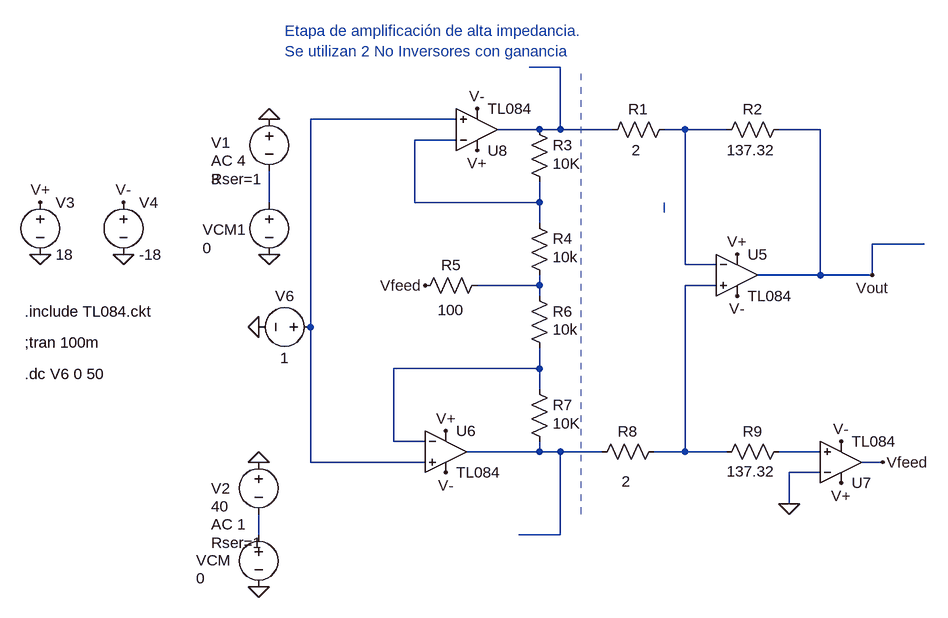
[diagram p0: schematic Draft1.asc]
Draft1.asc, the LTspice schematic file:
Version 4
SHEET 1 1008 680
WIRE 208 -240 160 -240
WIRE 48 -160 -176 -160
WIRE 176 -144 112 -144
WIRE 208 -144 208 -240
WIRE 208 -144 176 -144
WIRE 288 -144 208 -144
WIRE 400 -144 368 -144
WIRE 464 -144 400 -144
WIRE 608 -144 544 -144
WIRE 48 -128 -16 -128
WIRE -240 -32 -240 -80
WIRE -16 -32 -16 -128
WIRE 176 -32 176 -64
WIRE 176 -32 -16 -32
WIRE 176 0 176 -32
WIRE 768 32 688 32
WIRE 400 64 400 -144
WIRE 448 64 400 64
WIRE 608 80 608 -144
WIRE 608 80 512 80
WIRE 688 80 688 32
WIRE 688 80 608 80
WIRE 176 96 176 80
WIRE 176 96 80 96
WIRE 448 96 400 96
WIRE 176 112 176 96
WIRE -176 160 -176 -160
WIRE 176 224 176 192
WIRE 176 224 -48 224
WIRE 176 256 176 224
WIRE -48 336 -48 224
WIRE 0 336 -48 336
WIRE 176 352 176 336
WIRE 176 352 64 352
WIRE 208 352 176 352
WIRE 272 352 208 352
WIRE 400 352 400 96
WIRE 400 352 352 352
WIRE 464 352 400 352
WIRE 608 352 544 352
WIRE -176 368 -176 160
WIRE 0 368 -176 368
WIRE 704 368 672 368
WIRE 608 384 560 384
WIRE 560 432 560 384
WIRE -256 480 -256 448
WIRE 208 480 208 352
WIRE 208 480 144 480
FLAG 560 432 0
FLAG 704 368 Vfeed
FLAG 0 96 Vfeed
FLAG -256 560 0
FLAG -240 48 0
FLAG 688 80 Vout
FLAG -464 48 0
FLAG -592 48 0
FLAG -592 -32 V+
FLAG 80 -112 V+
FLAG 480 48 V+
FLAG 640 400 V+
FLAG 32 320 V+
FLAG -464 -32 V-
FLAG 80 -176 V-
FLAG 480 112 V-
FLAG 640 336 V-
FLAG 32 384 V-
FLAG -256 160 0
FLAG -256 368 0
FLAG -240 -160 0
DATAFLAG 768 32 ""
DATAFLAG 160 -240 ""
DATAFLAG 144 480 ""
SYMBOL res 160 -16 R0
WINDOW 3 36 68 Left 2
SYMATTR Value 10k
SYMATTR InstName R4
SYMBOL res 160 96 R0
WINDOW 3 36 68 Left 2
SYMATTR Value 10k
SYMATTR InstName R6
SYMBOL res 160 240 R0
WINDOW 3 36 68 Left 2
SYMATTR Value 10K
SYMATTR InstName R7
SYMBOL res 160 -160 R0
WINDOW 3 36 68 Left 2
SYMATTR Value 10K
SYMATTR InstName R3
SYMBOL res 384 -160 R90
WINDOW 0 0 56 VBottom 2
WINDOW 3 63 59 VBottom 2
SYMATTR InstName R1
SYMATTR Value 2
SYMBOL res 560 -160 R90
WINDOW 0 0 56 VBottom 2
WINDOW 3 63 59 VBottom 2
SYMATTR InstName R2
SYMATTR Value 137.32
SYMBOL res 368 336 R90
WINDOW 0 0 56 VBottom 2
WINDOW 3 77 59 VBottom 2
SYMATTR InstName R8
SYMATTR Value 2
SYMBOL res 96 80 R90
WINDOW 0 0 56 VBottom 2
WINDOW 3 69 56 VBottom 2
SYMATTR InstName R5
SYMATTR Value 100
SYMBOL res 560 336 R90
WINDOW 0 0 56 VBottom 2
WINDOW 3 62 59 VBottom 2
SYMATTR InstName R9
SYMATTR Value 137.32
SYMBOL voltage -240 -176 R0
WINDOW 0 -89 52 Left 2
WINDOW 123 -89 80 Left 2
WINDOW 39 -89 108 Left 2
WINDOW 3 -89 108 Left 2
SYMATTR InstName V1
SYMATTR Value2 AC 4
SYMATTR SpiceLine Rser=1
SYMATTR Value 3
SYMBOL voltage -256 352 R0
WINDOW 0 -73 56 Left 2
WINDOW 3 -73 84 Left 2
WINDOW 123 -73 112 Left 2
WINDOW 39 -73 140 Left 2
SYMATTR InstName V2
SYMATTR Value 40
SYMATTR Value2 AC 1
SYMATTR SpiceLine Rser=1
SYMBOL voltage -240 -48 R0
WINDOW 0 -102 58 Left 2
WINDOW 123 0 0 Left 0
WINDOW 39 0 0 Left 0
WINDOW 3 -102 86 Left 2
SYMATTR InstName VCM1
SYMATTR Value 0
SYMBOL voltage -256 464 R0
WINDOW 0 -96 55 Left 2
WINDOW 123 0 0 Left 0
WINDOW 39 0 0 Left 0
WINDOW 3 -96 83 Left 2
SYMATTR InstName VCM
SYMATTR Value 0
SYMBOL Opamps\\opamp2 480 16 R0
SYMATTR InstName U5
SYMATTR Value TL084
SYMBOL Opamps\\opamp2 32 288 R0
SYMATTR InstName U6
SYMATTR Value TL084
SYMBOL Opamps\\opamp2 640 432 M180
SYMATTR InstName U7
SYMATTR Value TL084
SYMBOL Opamps\\opamp2 80 -80 M180
SYMATTR InstName U8
SYMATTR Value TL084
SYMBOL voltage -592 -48 R0
WINDOW 123 0 0 Left 0
WINDOW 39 0 0 Left 0
SYMATTR InstName V3
SYMATTR Value 18
SYMBOL voltage -464 -48 R0
WINDOW 123 0 0 Left 0
WINDOW 39 0 0 Left 0
SYMATTR InstName V4
SYMATTR Value -18
SYMBOL voltage -160 160 R90
WINDOW 0 -32 56 VBottom 2
WINDOW 3 32 56 VTop 2
WINDOW 123 0 0 Left 0
WINDOW 39 0 0 Left 0
SYMATTR InstName V6
SYMATTR Value 1
TEXT -616 136 Left 2 !.include TL084.ckt
TEXT -616 184 Left 2 !;tran 100m
TEXT -216 -296 Left 2 ;Etapa de amplificación de alta impedancia.\nSe utilizan 2 No Inversores con ganancia
TEXT -616 232 Left 2 !.dc V6 0 50
LINE Normal 240 448 240 -240 1
CIRCLE Normal 368 -16 368 -32 1

The netlist it stands for:
* Draft1.asc
R4 N004 N006 10k
R6 N006 N008 10k
R7 N008 N009 10K
R3 N001 N004 10K
R1 N003 N001 2
R2 Vout N003 137.32
R8 N007 N009 2
R5 N006 Vfeed 100
R9 N010 N007 137.32
V1 0 N005 3 AC 4 Rser=1
V2 0 N011 40 AC 1 Rser=1
VCM1 N005 0 0
VCM N011 0 0
XU5 N007 N003 V+ V- Vout TL084  ; pins In+ In- V+ V- OUT
XU6 N002 N008 V+ V- N009 TL084  ; pins In+ In- V+ V- OUT
XU7 N010 0 V+ V- Vfeed TL084  ; pins In+ In- V+ V- OUT
XU8 N002 N004 V+ V- N001 TL084  ; pins In+ In- V+ V- OUT
V3 V+ 0 18
V4 V- 0 -18
V6 N002 0 1
.include TL084.ckt
;tran 100m
* Etapa de amplificación de alta impedancia.
* Se utilizan 2 No Inversores con ganancia
.dc V6 0 50
.backanno
.end